# EasyEDA schematic SCH_y262lpt v0.3b_2022-03-30.json

## Sheets
1 MAIN copy: TITLE: Sheet_1; REV: 1.0; Date: 2022-03-24; Sheet: 1/1; Drawn By: Denjhang; Company: Your Company
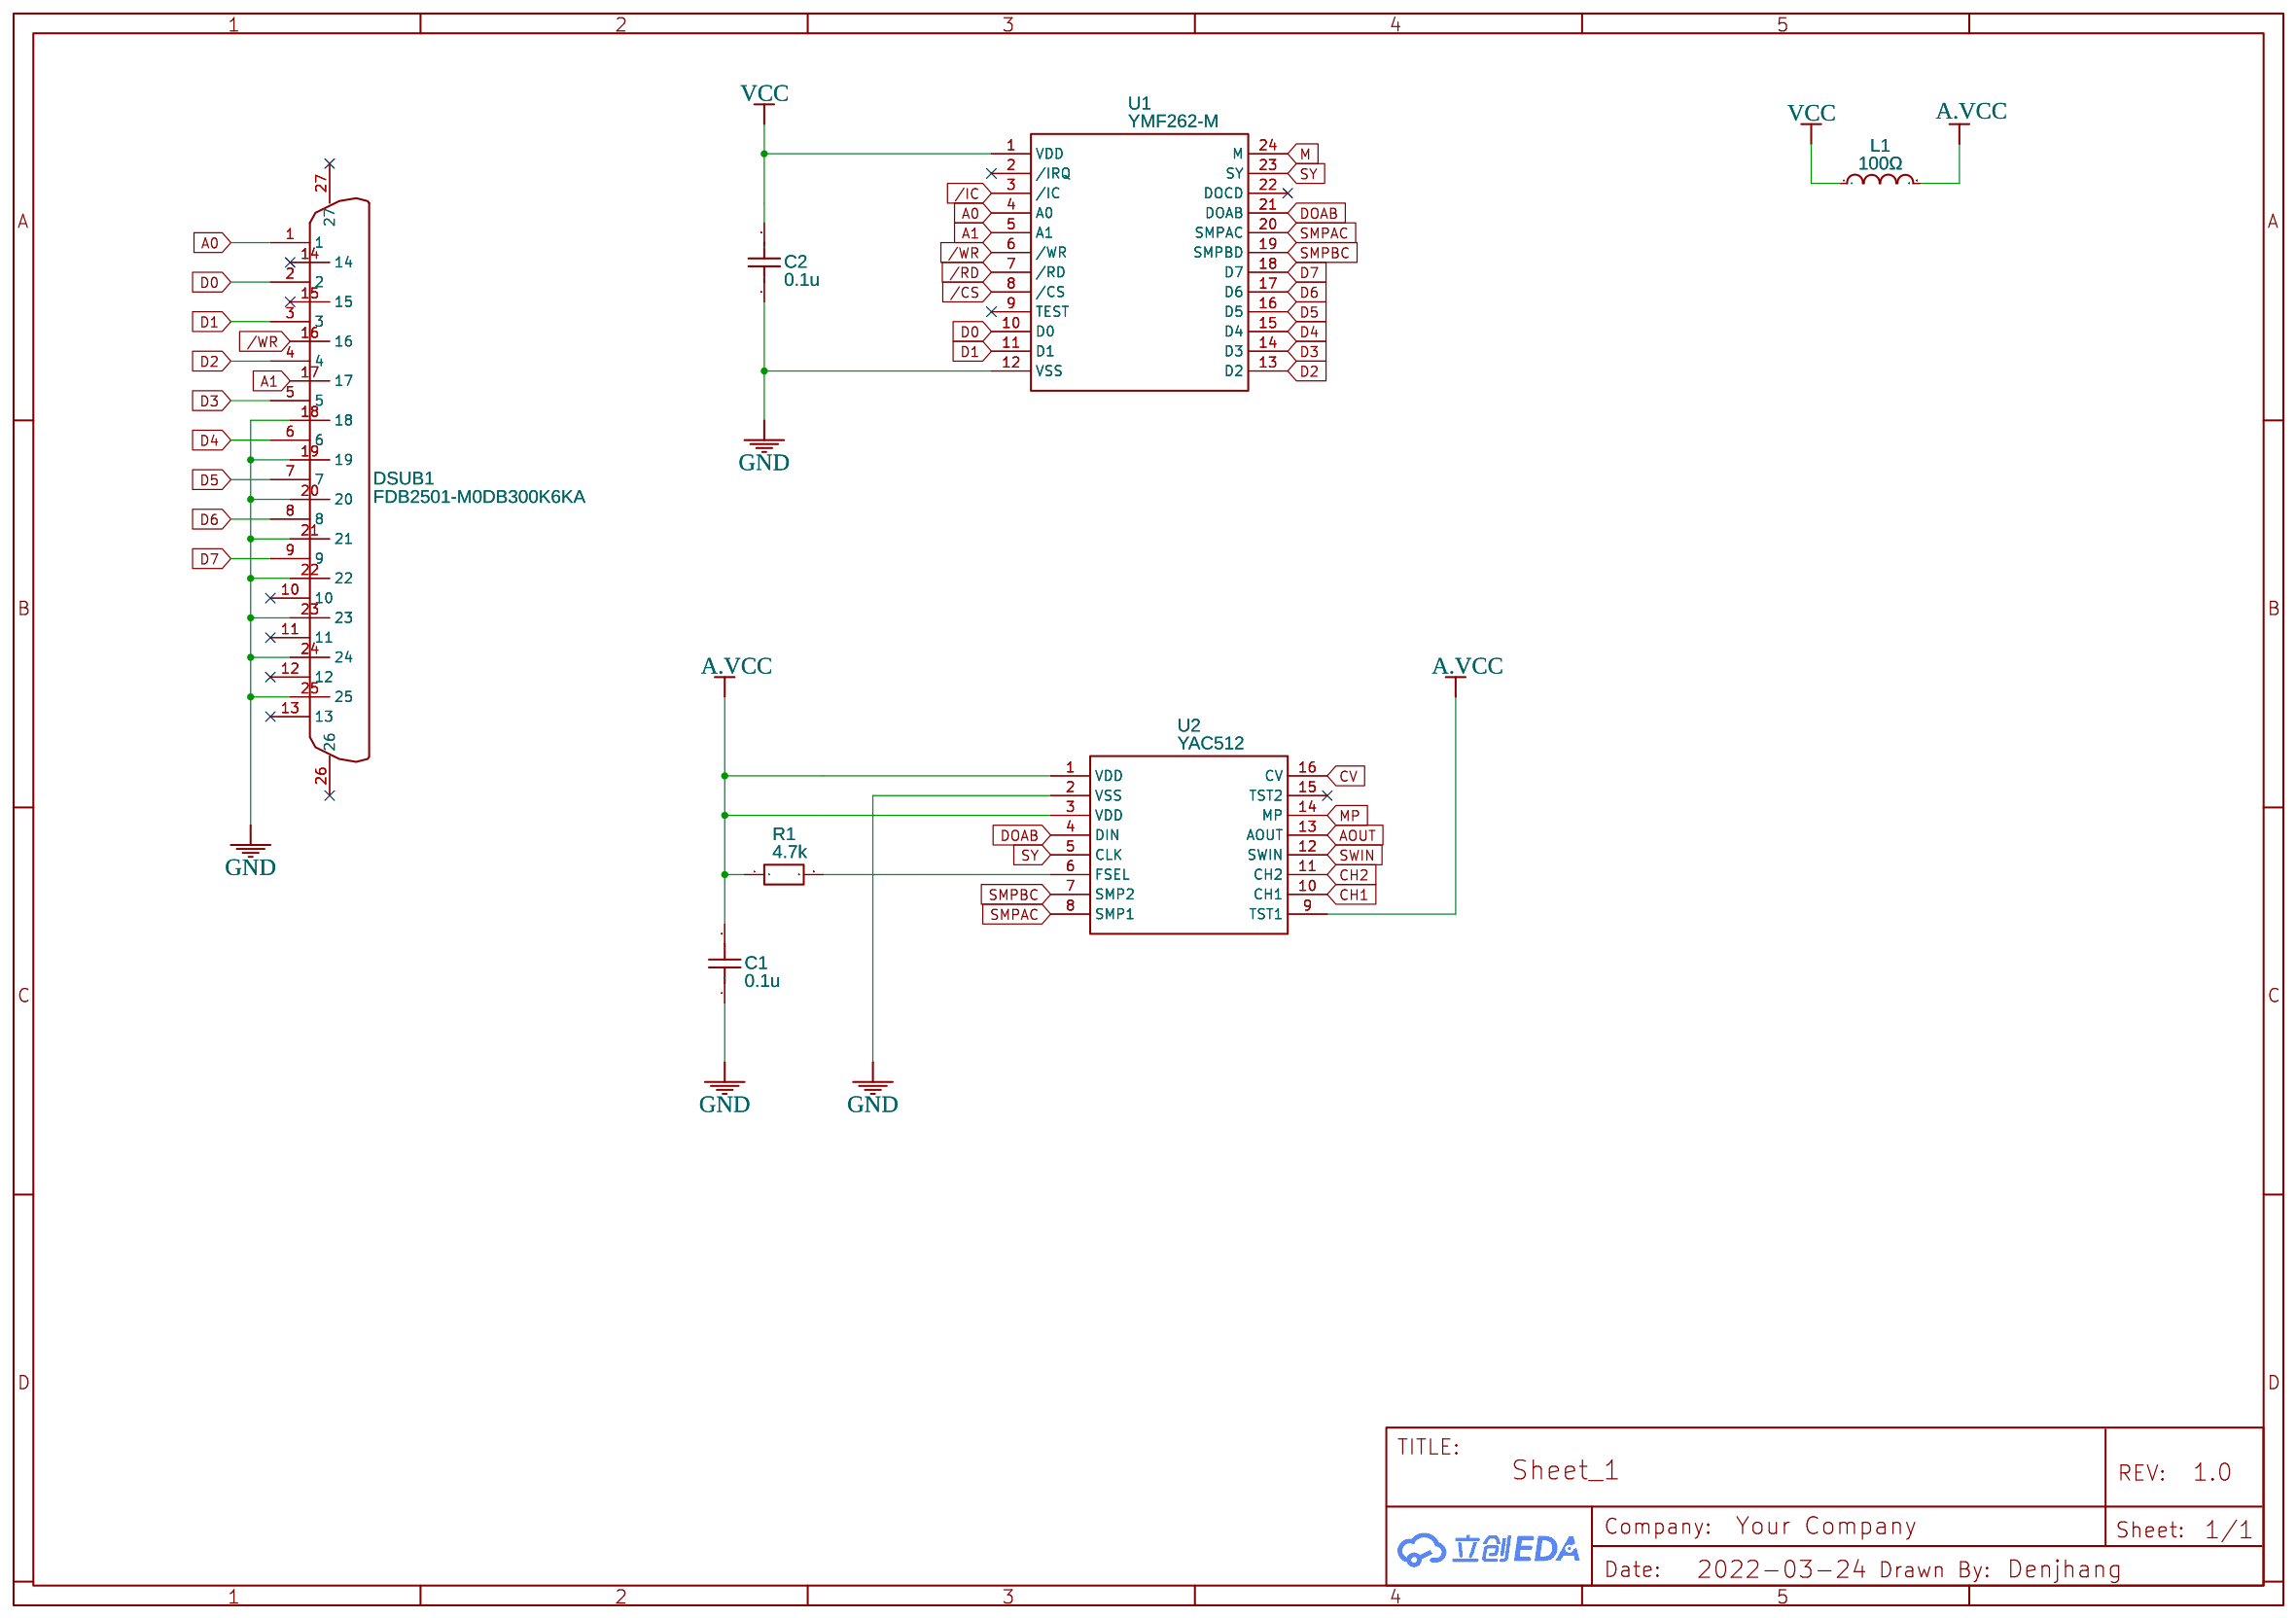
[diagram p0: MAIN copy]
2 AMP1 copy
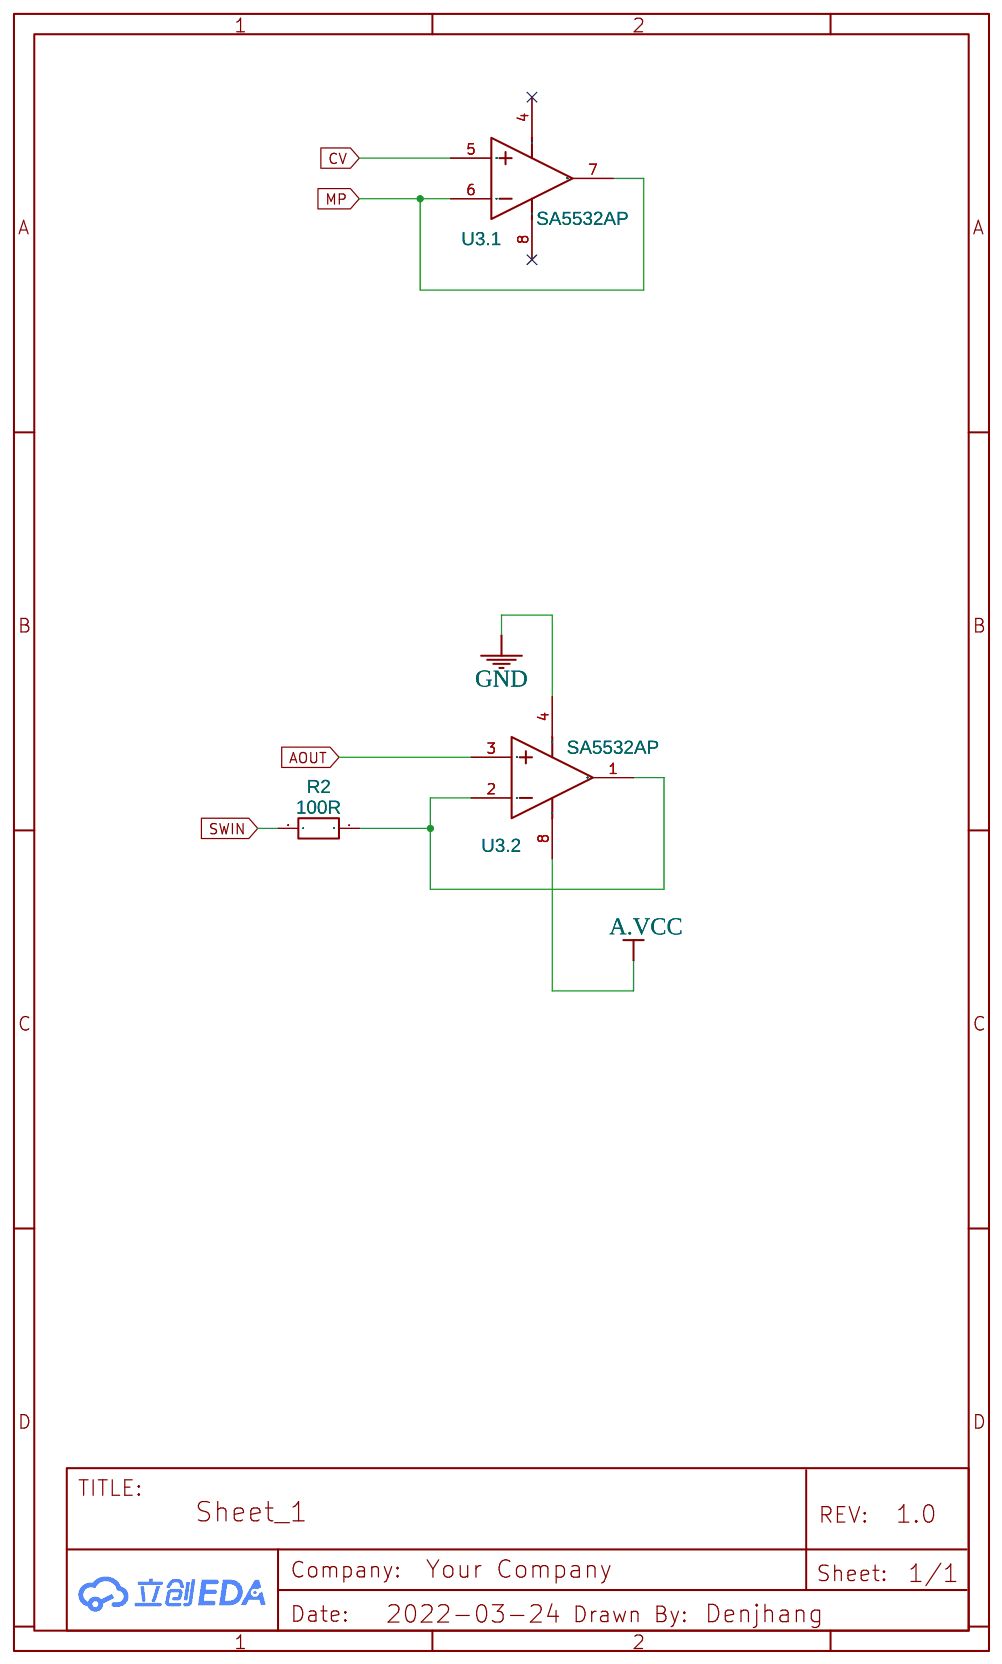
[diagram p1: AMP1 copy]
3 AMP2 copy
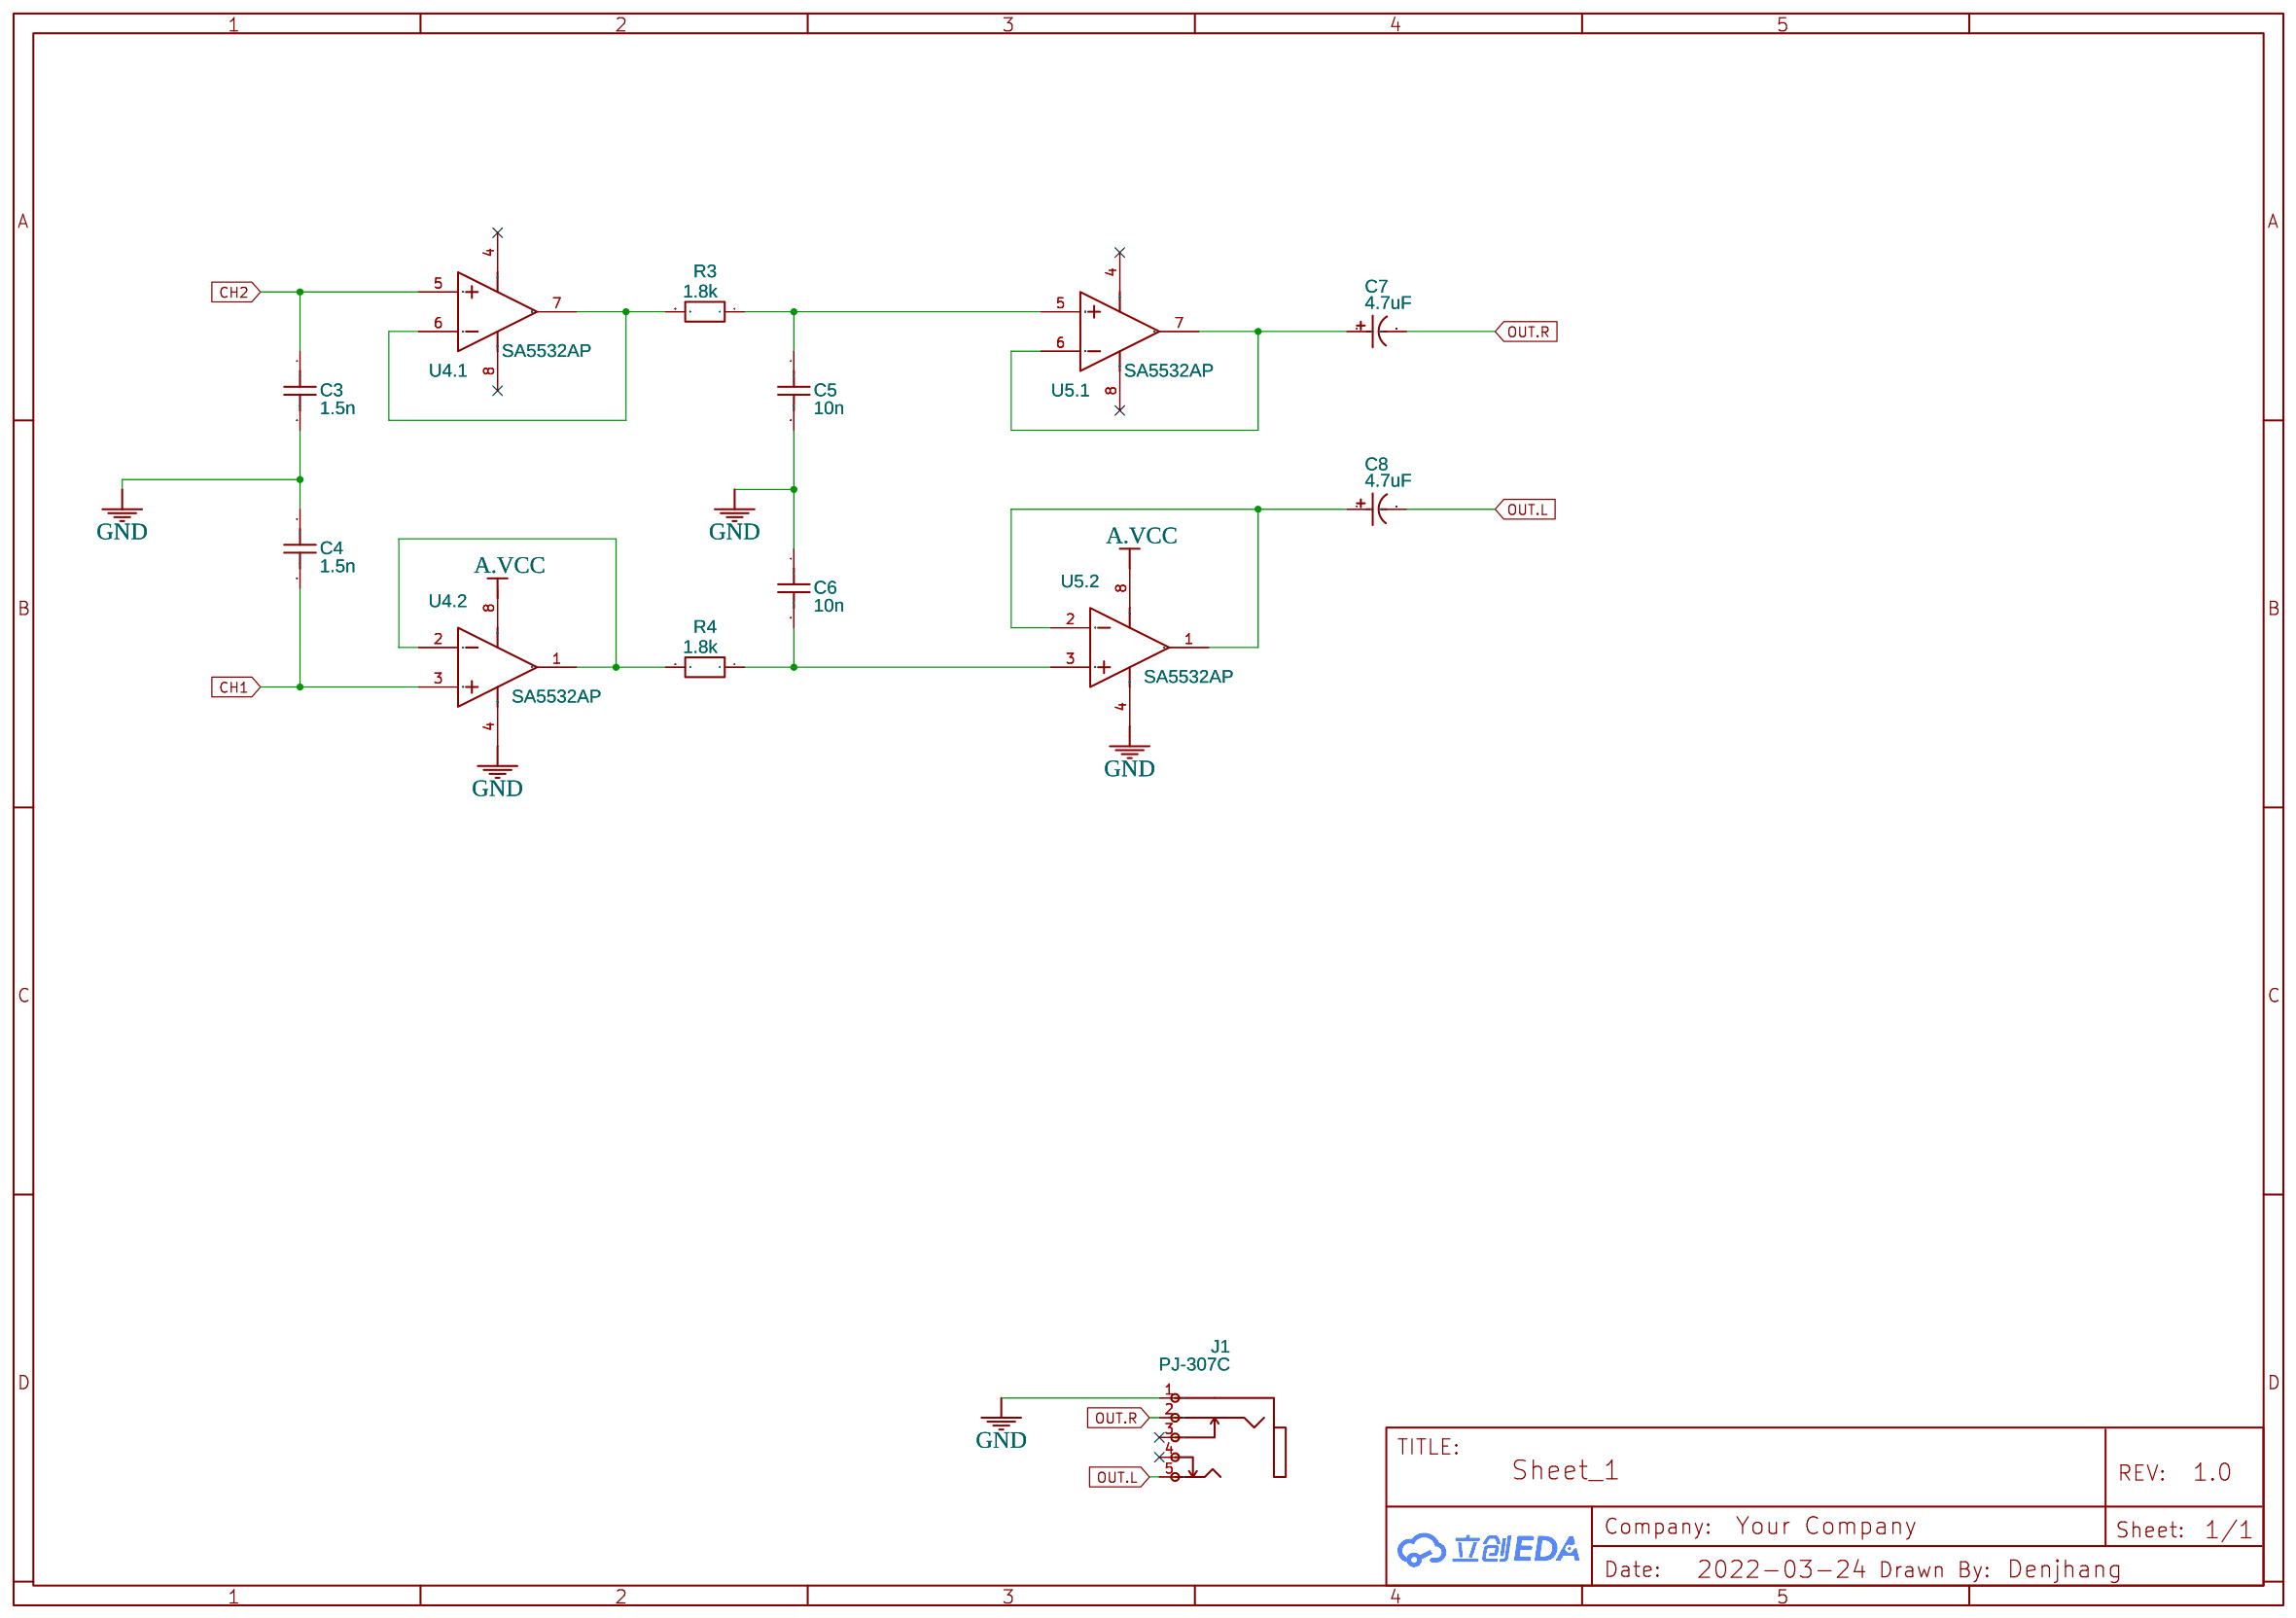
[diagram p2: AMP2 copy]
4 MISC copy
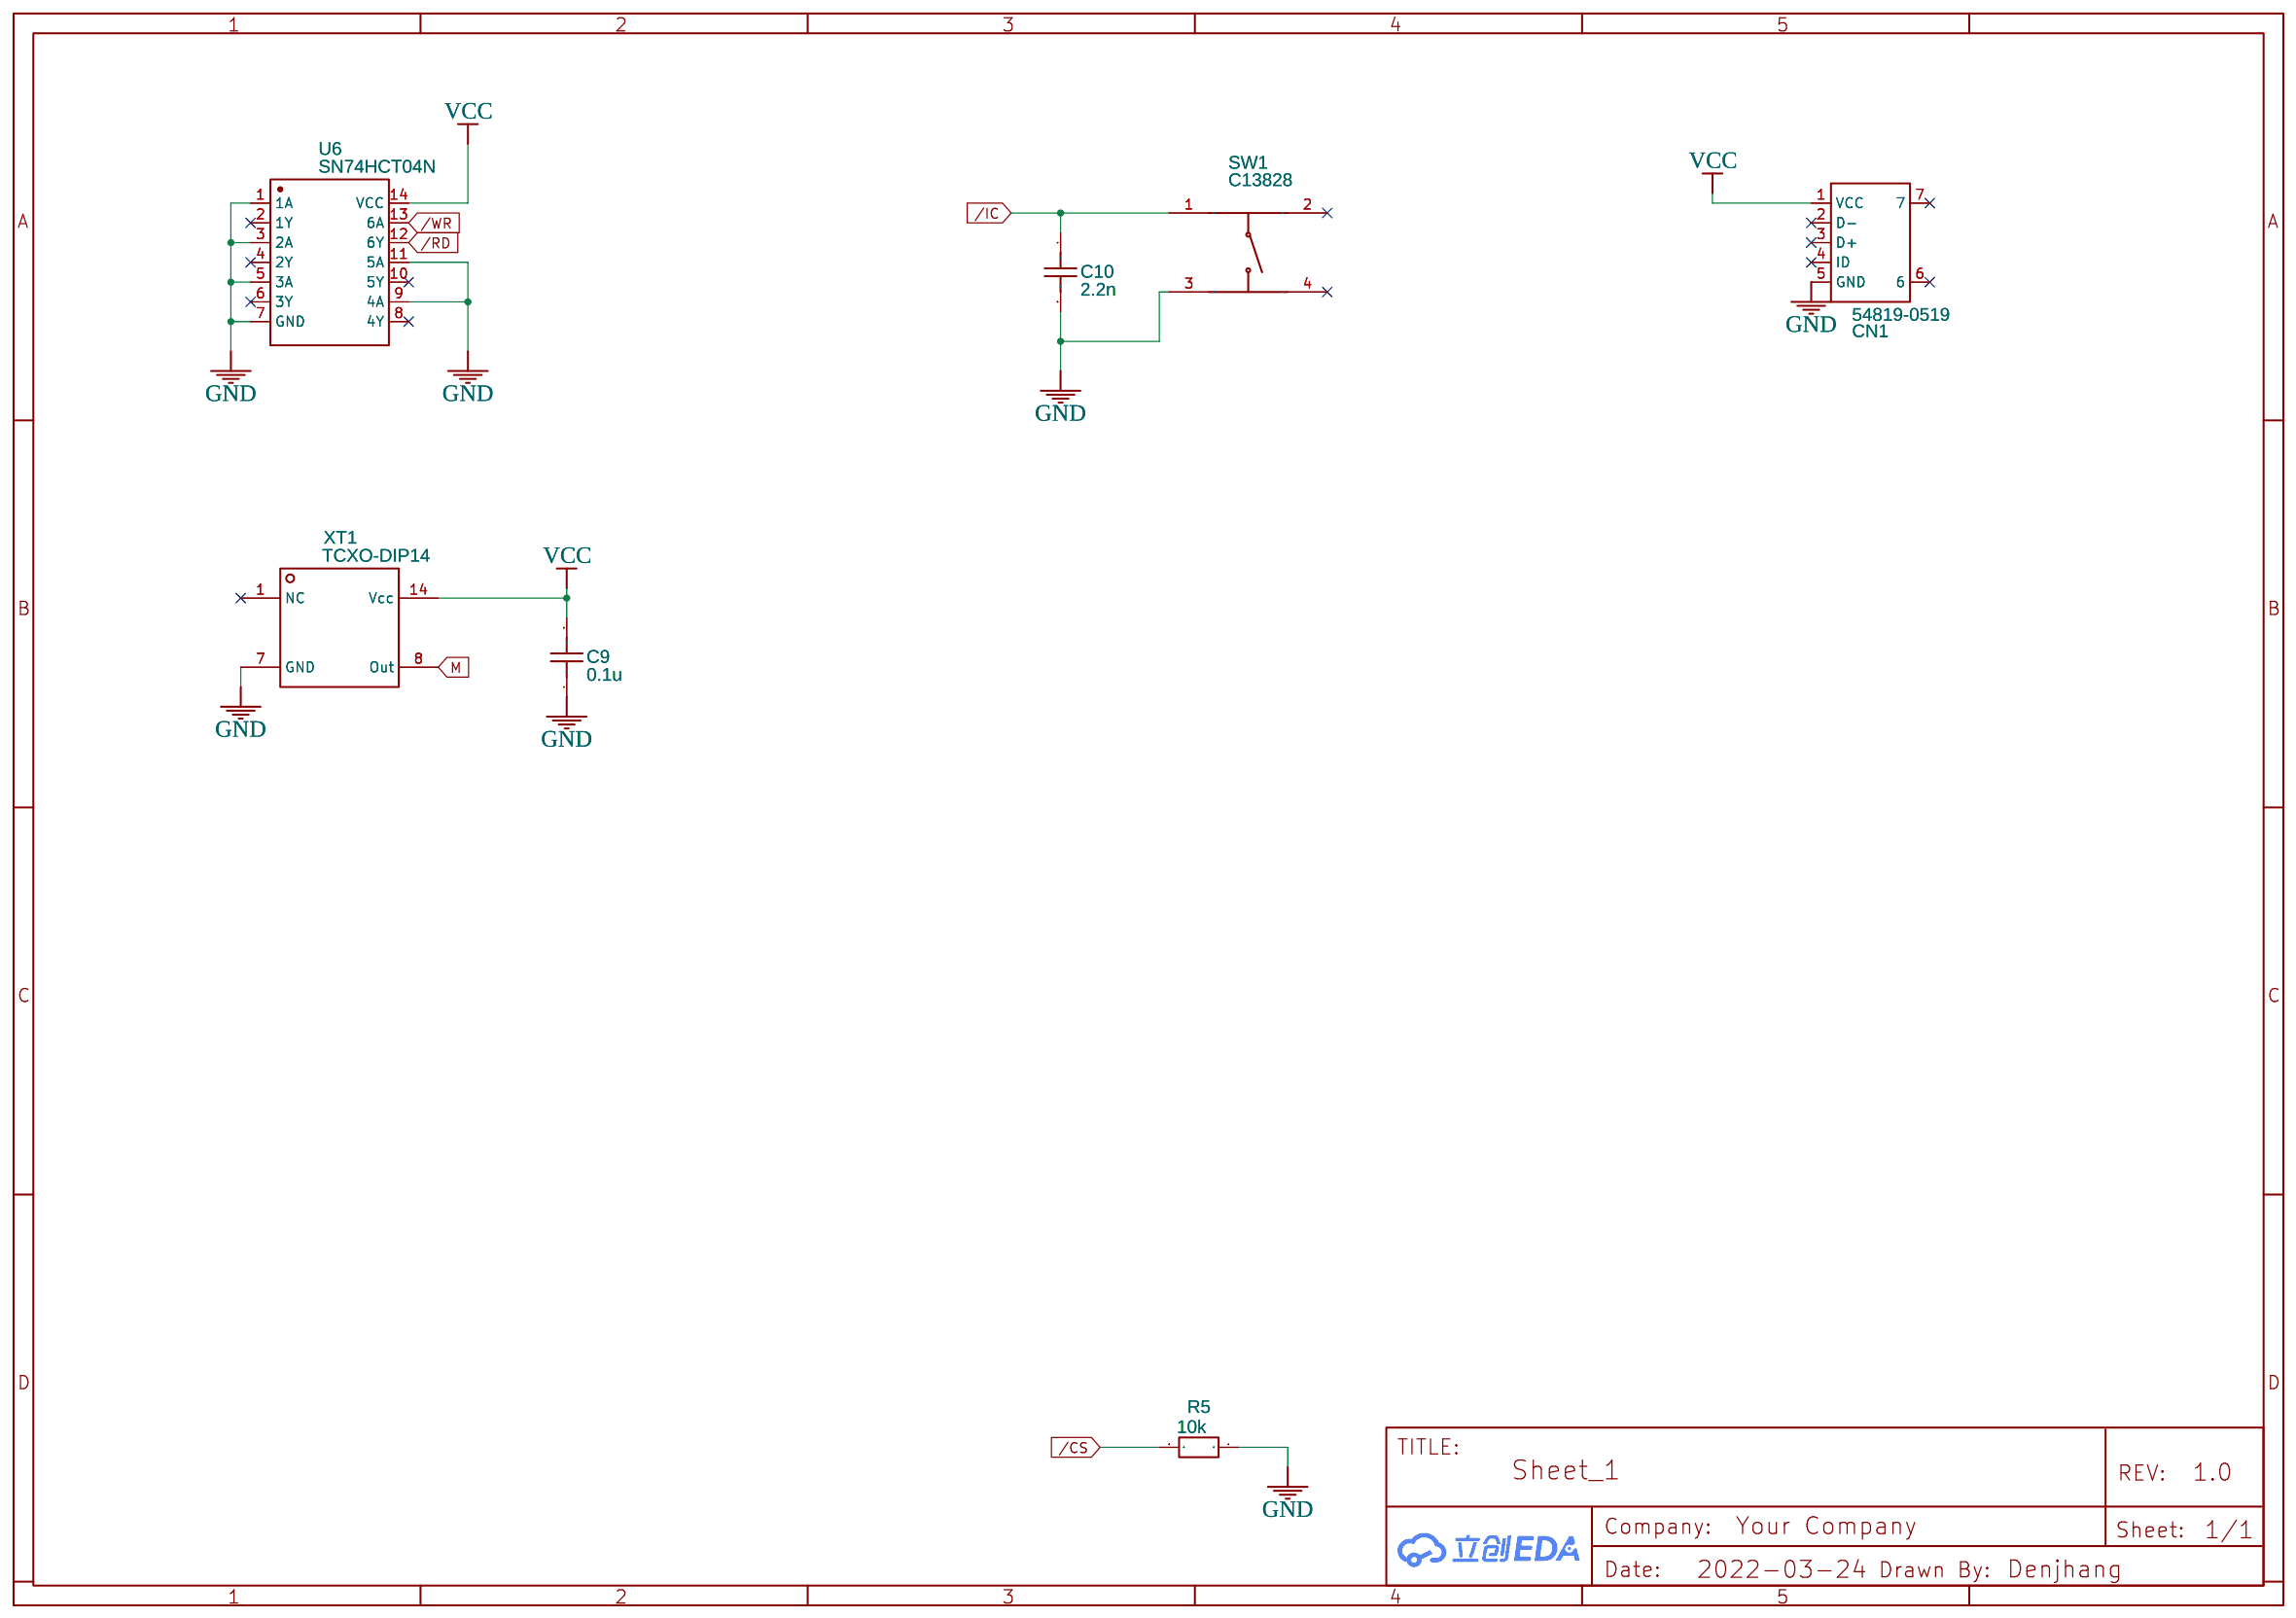
[diagram p3: MISC copy]

## Parts
sheet AMP1 copy
R2  100R  [R0603]
U3  SA5532AP  [DIP8]  (sections 1,2)
sheet AMP2 copy
C3  1.5n  [C0603]
C4  1.5n  [C0603]
C5  10n  [C0603]
C6  10n  [C0603]
C7  4.7uF  [CAP-TH_BD6.3-P2.50-D1.0-FD]
C8  4.7uF  [CAP-TH_BD6.3-P2.50-D1.0-FD]
J1  PJ-307C  [AUDIO-TH_PJ307C]
R3  1.8k  [R0603]
R4  1.8k  [R0603]
U4  SA5532AP  [DIP8]  (sections 1,2)
U5  SA5532AP  [DIP8]  (sections 1,2)
sheet MAIN copy
C1  0.1u  [C0603]
C2  0.1u  [C0603]
DSUB1  FDB2501-M0DB300K6KA  [DB25-TH_FDB2501-M0DB300K6KA]
L1  100Ω  [L0603]
R1  4.7k  [R0603]
U1  YMF262-M  [YMF262-M]
U2  YAC512  [SOP-16_L10.3-W5.4-P1.27-LS7.8-BL]
sheet MISC copy
C9  0.1u  [C0603]
C10  2.2n  [C0603]
CN1  54819-0519  [USB-MINI-SMD_5P-P0.80-H-F_54819-0519]
R5  10k  [R0603]
SW1  C13828  [SW-TH_4P-L6.0-W6.0-P4.50-LS6.5]
U6  SN74HCT04N  [DIP-14_L19.0-W7.0-P2.54-LS7.6-BL]
XT1  TCXO-DIP14  [TCXO-DIP-14-FOOT]

## Library data of the parts
R1-R5 = R_0603_EU: Contributor: LCEDA_Lib
U3-U5 = SA5532AP: Dual Low-Noise Operational Amplifier, 10 to 30 V, -40 to 85 degC, 8-pin DIP (P8), Pb-Free (RoHS); subpart_no: 1
C1-C6 C9 C10 = C_0603_US: Contributor: LCEDA_Lib
C7 C8 = 25V 47uF: Supplier: LCSC; Manufacturer: ValuePro; Manufacturer Part: 电解电容25V 47uF; Supplier Part: C45704; JLCPCB Part Class: Extended Part
J1 = PJ-307C: Supplier: LCSC; Manufacturer: BOOMELE; Supplier Part: C16684; JLCPCB Part Class: Extended Part
DSUB1 = FDB2501-M0DB300K6KA: Supplier: LCSC; Supplier Part: C2834344; Manufacturer: TXGA(特思嘉); Contributor: LCSC
L1 = CBW160808U102T: Supplier: LCSC; Manufacturer: FH; Supplier Part: C50069; JLCPCB Part Class: Extended Part
U1 = YMF262-M: Manufacturer: YAMAHA; Contributor: re1mu
U2 = YAC512: Manufacturer: YAMAHA; Contributor: re1mu
CN1 = 54819-0519: Supplier: LCSC; Supplier Part: C240850; Manufacturer: MOLEX; Contributor: LCSC; JLCPCB Part Class: Extended Part
SW1 = C13828: Supplier: LCSC; Manufacturer: Dongguan Guangzhu Industrial; Contributor: LCSC; JLCPCB Part Class: Extended Part
U6 = SN74HCT04N: Supplier: LCSC; Manufacturer: TI; Contributor: LCSC; Supplier Part: C50939; JLCPCB Part Class: Extended Part
XT1 = TCXO-DIP14: Contributor: zhouhance

## Nets
GND: C1.1 C2.1 C3.2 C4.1 C5.2 C6.1 C9.1 C10.2 CN1.5(GND) DSUB1.18 DSUB1.19 DSUB1.20 DSUB1.21 DSUB1.22 DSUB1.23 DSUB1.24 DSUB1.25 J1.1 R5.1 SW1.3 U1.12(VSS) U2.2(VSS) U3.4(VCC-) U4.4(VCC-) U5.4(VCC-) U6.1(1A) U6.3(2A) U6.5(3A) U6.7(GND) U6.9(4A) U6.11(5A) XT1.7(GND)
VCC: C2.2 C9.2 CN1.1(VCC) L1.1 U1.1(VDD) U6.14(VCC) XT1.14(Vcc)
/CS: R5.2 U1.8(/CS)
/IC: C10.1 SW1.1 U1.3(/IC)
/RD: U1.7(/RD) U6.12(6Y)
/WR: DSUB1.16 U1.6(/WR) U6.13(6A)
A0: DSUB1.1 U1.4(A0)
A1: DSUB1.17 U1.5(A1)
A.VCC: C1.2 L1.2 R1.1 U2.1(VDD) U2.3(VDD) U2.9(TST1) U3.8(VCC+) U4.8(VCC+) U5.8(VCC+)
AOUT: U2.13(AOUT) U3.3(IN1+)
CH1: C4.2 U2.10(CH1) U4.3(IN1+)
CH2: C3.1 U2.11(CH2) U4.5(IN2+)
CV: U2.16(CV) U3.5(IN2+)
D0: DSUB1.2 U1.10(D0)
D1: DSUB1.3 U1.11(D1)
D2: DSUB1.4 U1.13(D2)
D3: DSUB1.5 U1.14(D3)
D4: DSUB1.6 U1.15(D4)
D5: DSUB1.7 U1.16(D5)
D6: DSUB1.8 U1.17(D6)
D7: DSUB1.9 U1.18(D7)
DOAB: U1.21(DOAB) U2.4(DIN)
M: U1.24(M) XT1.8(Out)
MP: U2.14(MP) U3.6(IN2-) U3.7(OUT2)
OUT.L: C8.2 J1.5
OUT.R: C7.2 J1.2
SMPAC: U1.20(SMPAC) U2.8(SMP1)
SMPBC: U1.19(SMPBD) U2.7(SMP2)
SWIN: R2.2 U2.12(SWIN)
SY: U1.23(SY) U2.5(CLK)
Net-(C5-1): C5.1 R3.1 U5.5(IN2+)
Net-(C6-2): C6.2 R4.1 U5.3(IN1+)
Net-(C7-1): C7.1 U5.6(IN2-) U5.7(OUT2)
Net-(C8-1): C8.1 U5.1(OUT1) U5.2(IN1-)
Net-(R1-2): R1.2 U2.6(FSEL)
Net-(R2-1): R2.1 U3.1(OUT1) U3.2(IN1-)
Net-(R3-2): R3.2 U4.6(IN2-) U4.7(OUT2)
Net-(R4-2): R4.2 U4.1(OUT1) U4.2(IN1-)

Not connected (* = marked no-connect by the designer): CN1 2(D-)* 3(D+)* 4(ID)* 6* 7*; DSUB1 10* 11* 12* 13* 14* 15* 26* 27*; J1 3* 4*; SW1 2* 4*; U1 2(/IRQ)* 9(TEST)* 22(DOCD)*; U2 15(TST2)*; U6 2(1Y)* 4(2Y)* 6(3Y)* 8(4Y)* 10(5Y)*; XT1 1(NC)*
